# Altium schematic sheet PowerSupply.SchDoc
size A3; SheetNumber: 3; SheetTotal: 6
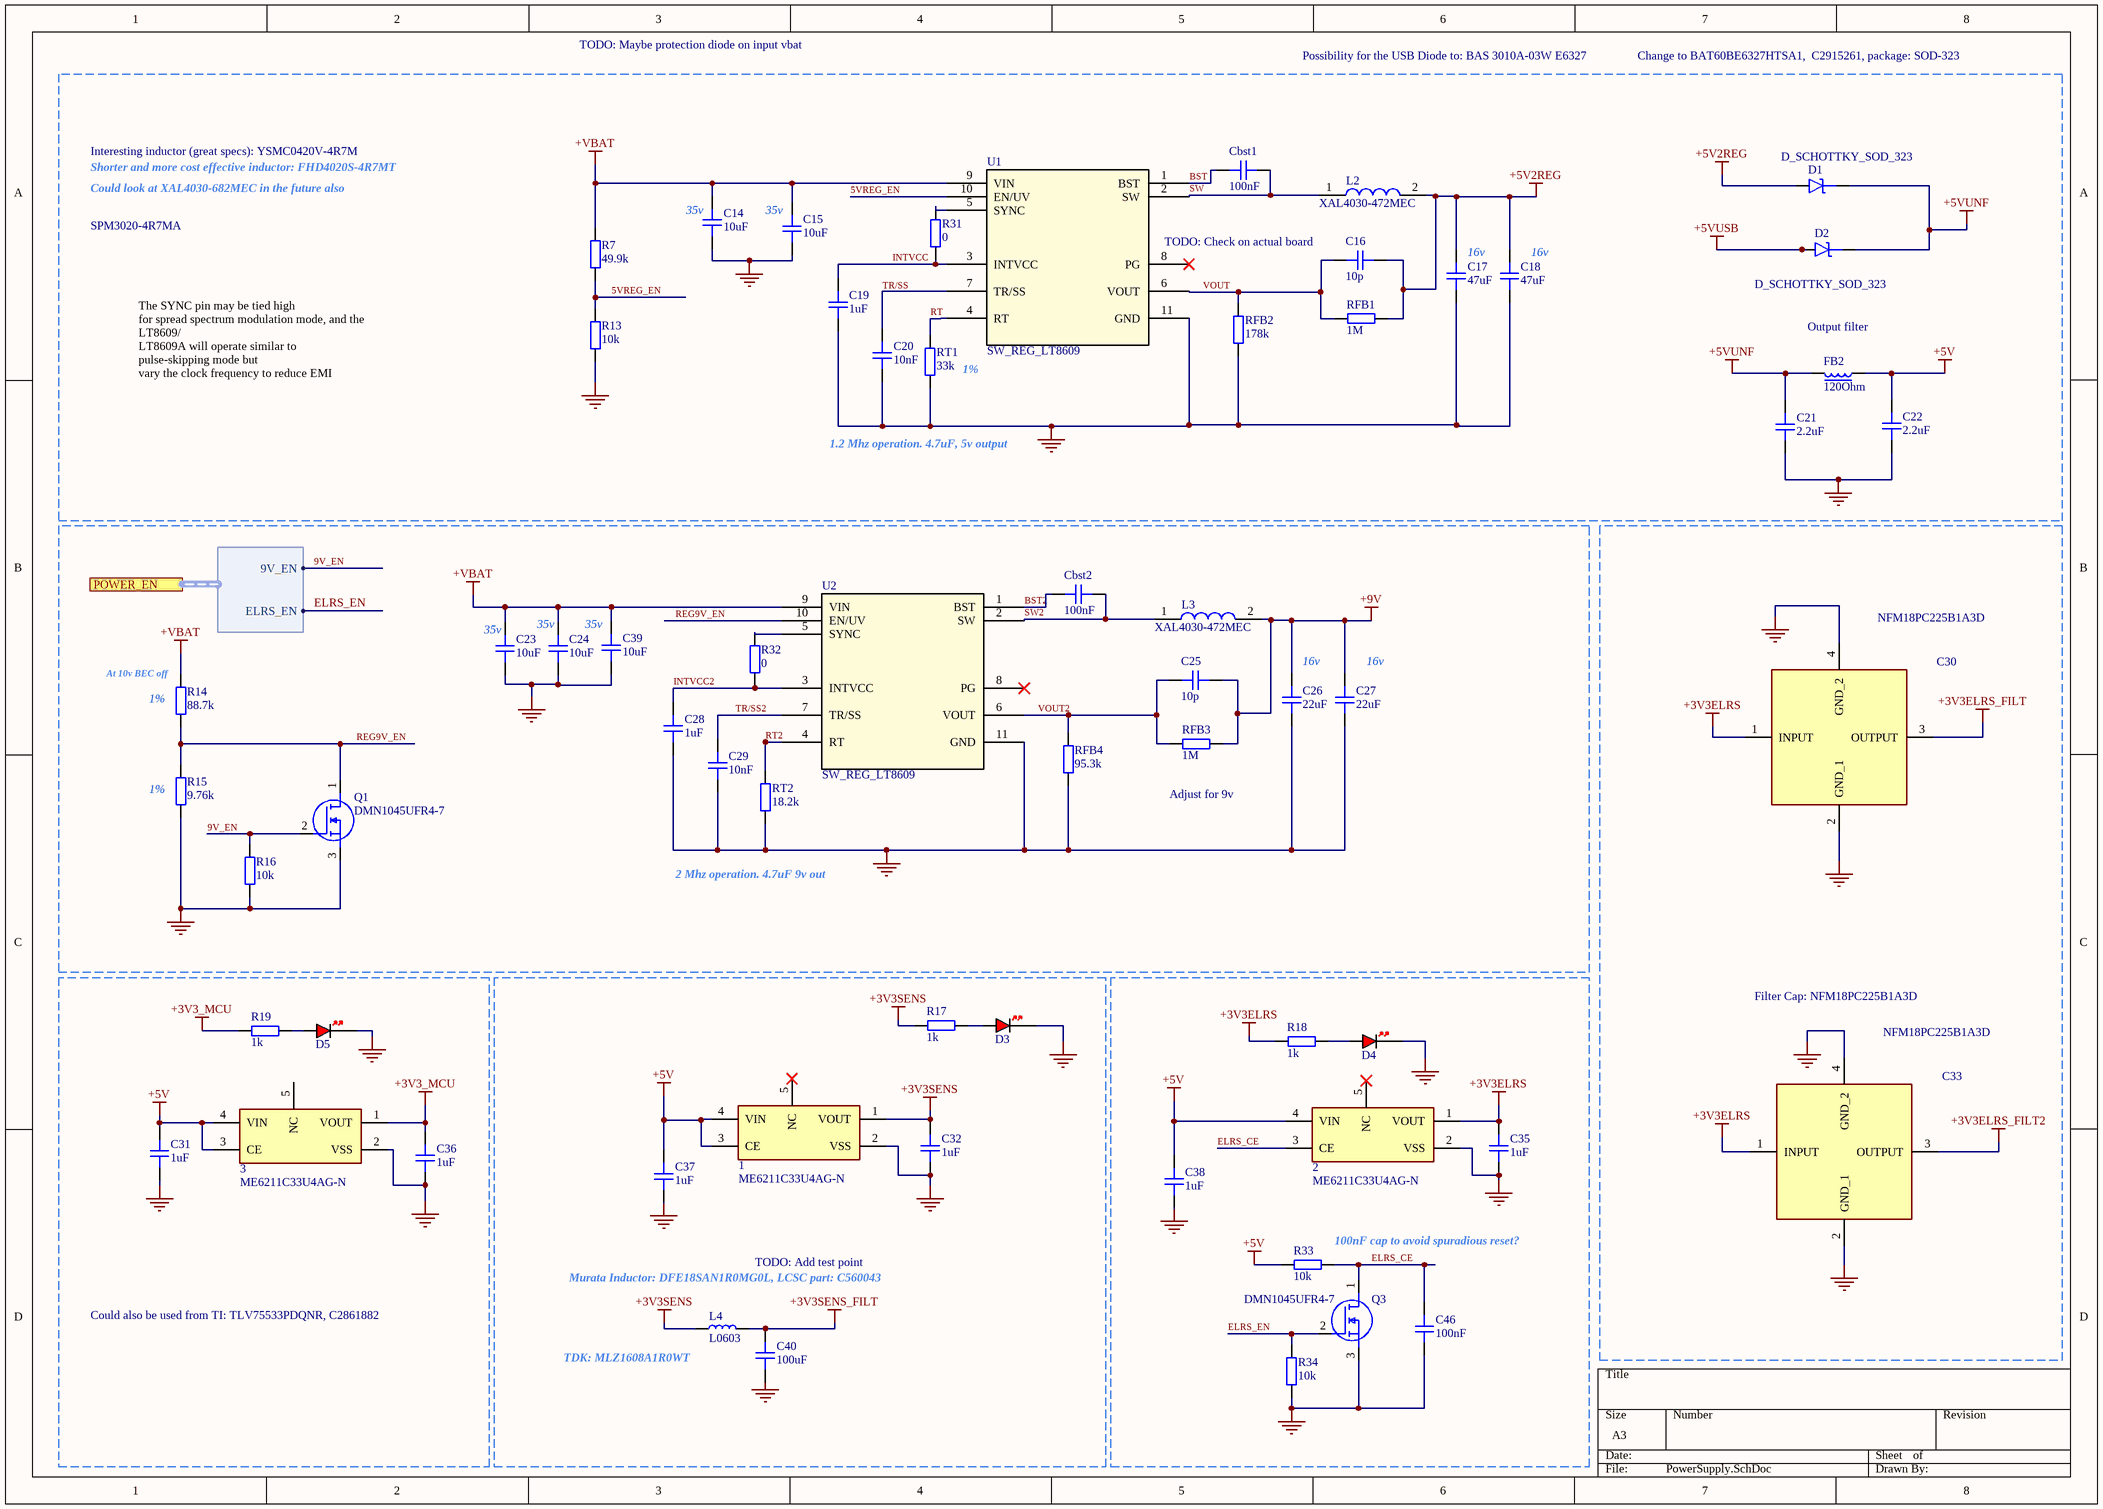
[diagram p0: PowerSupply.SchDoc]

## Parts
1  ME6211C33U4AG-N  [X2-SON-4-EP(1x1)]
2  ME6211C33U4AG-N  [X2-SON-4-EP(1x1)]
3  ME6211C33U4AG-N  [X2-SON-4-EP(1x1)]
C14  10uF  [CAP_0805]
C15  10uF  [CAP_0805]
C16  10p  [CAP_0201]
C17  47uF  [CAP_0603]
C18  47uF  [CAP_0603]
C19  1uF  [CAP_0402]
C20  10nF  [CAP_0201]
C21  2.2uF  [CAP_0402]
C22  2.2uF  [CAP_0402]
C23  10uF  [CAP_0805]
C24  10uF  [CAP_0805]
C25  10p  [CAP_0201]
C26  22uF  [CAP_0603]
C27  22uF  [CAP_0603]
C28  1uF  [CAP_0402]
C29  10nF  [CAP_0201]
C30  NFM18PC225B1A3D  [NFM18PC225B1A3D]
C31  1uF  [CAP_0402]
C32  1uF  [CAP_0402]
C33  NFM18PC225B1A3D  [NFM18PC225B1A3D]
C35  1uF  [CAP_0402]
C36  1uF  [CAP_0402]
C37  1uF  [CAP_0402]
C38  1uF  [CAP_0402]
C39  10uF  [CAP_0603]
C40  100uF  [CAP_0805]
C46  100nF  [CAP_0201]
Cbst1  100nF  [CAP_0201]
Cbst2  100nF  [CAP_0201]
D1  D_SCHOTTKY_SOD_323  [SOD-323]
D2  D_SCHOTTKY_SOD_323  [SOD-323]
D3  RED  [LED_0402_RED]  (value not drawn)
D4  RED  [LED_0402_RED]  (value not drawn)
D5  RED  [LED_0402_RED]  (value not drawn)
FB2  120Ohm  [FB_0603]
L2  XAL4030-472MEC  [IND-SMD_L4.0-W4.0]
L3  XAL4030-472MEC  [IND-SMD_L4.0-W4.0]
L4  L0603  [IND_0603]
Q1  DMN1045UFR4-7  [DMP1200UFR47]
Q3  DMN1045UFR4-7  [DMP1200UFR47]
R7  49.9k  [RES_0402]
R13  10k  [RES_0201]
R14  88.7k  [RES_0402]
R15  9.76k  [RES_0201]
R16  10k  [RES_0201]
R17  1k  [RES_0201]
R18  1k  [RES_0201]
R19  1k  [RES_0201]
R31  0  [RES_0201]
R32  0  [RES_0201]
R33  10k  [RES_0201]
R34  10k  [RES_0201]
RFB1  1M  [RES_0201]
RFB2  178k  [RES_0201]
RFB3  1M  [RES_0201]
RFB4  95.3k  [RES_0201]
RT1  33k  [RES_0201]
RT2  18.2k  [RES_0201]
U1  SW_REG_LT8609  [SW_REG_LT8609]
U2  SW_REG_LT8609  [SW_REG_LT8609]

## Blocks framed on the sheet
Filter Cap: NFM18PC225B1A3D: C30 C33
Could also be used from TI: TLV75533PDQNR, C2861882: 3 C31 C36 D5 R19
100nF cap to avoid spuradious reset?: 2 C35 C38 C46 D4 Q3 R18 R33 R34

## Ports
POWER_EN (harness VTX_EN, see Overview[1A], MCU[8C])

## Harnesses
VTX_EN: 9V_EN, ELRS_EN

## Nets
+3V3_MCU: 3.1(VOUT) C36.2 R19.1
+3V3ELRS: 2.1(VOUT) C30.1(INPUT) C33.1(INPUT) C35.2 R18.1
+3V3ELRS_FILT: C30.3(OUTPUT)
+3V3ELRS_FILT2: C33.3(OUTPUT)
+3V3SENS: 1.1(VOUT) C32.2 L4.1 R17.1
+3V3SENS_FILT: C40.2 L4.2
+5V: 1.3(CE) 1.4(VIN) 2.4(VIN) 3.3(CE) 3.4(VIN) C22.2 C31.2 C37.2 C38.2 FB2.1 R33.2
+5V2REG: C16.2 C17.1 C18.1 D1.A L2.2 RFB1.1
+5VUNF: C21.2 D1.K D2.K FB2.2
+5VUSB: D2.A
+9V: C25.2 C26.1 C27.1 L3.2 RFB3.1
+VBAT: C14.2 C15.2 C23.2 C24.2 C39.2 R7.2 R14.2 U1.9(VIN) U2.9(VIN)
GND: 1.2(VSS) 2.2(VSS) 3.2(VSS) C14.1 C15.1 C17.2 C18.2 C19.1 C20.1 C21.1 C22.1 C23.1 C24.1 C26.2 C27.2 C28.1 C29.1 C30.2(GND_1) C30.4(GND_2) C31.1 C32.1 C33.2(GND_1) C33.4(GND_2) C35.1 C36.1 C37.1 C38.1 C39.1 C40.1 C46.1 D3.K D4.K D5.K Q1.3(S) Q3.3(S) R13.1 R15.1 R16.1 R34.1 RFB2.1 RFB4.1 RT1.1 RT2.2 U1.11(GND) U2.11(GND)
5VREG_EN: R7.1 R13.2 U1.10(EN/UV)
9V_EN: Q1.2(G) R16.2 ; port POWER_EN.9V_EN
BST: Cbst1.1 U1.1(BST)
BST2: Cbst2.1 U2.1(BST)
ELRS_CE: 2.3(CE) C46.2 Q3.1(D) R33.1
ELRS_EN: Q3.2(G) R34.2 ; port POWER_EN.ELRS_EN
INTVCC: C19.2 R31.1 U1.3(INTVCC)
INTVCC2: C28.2 R32.1 U2.3(INTVCC)
REG9V_EN: Q1.1(D) R14.1 R15.2 U2.10(EN/UV)
RT: RT1.2 U1.4(RT)
RT2: RT2.1 U2.4(RT)
SW: Cbst1.2 L2.1 U1.2(SW)
SW2: Cbst2.2 L3.1 U2.2(SW)
TR/SS: C20.2 U1.7(TR/SS)
TR/SS2: C29.2 U2.7(TR/SS)
VOUT: C16.1 RFB1.2 RFB2.2 U1.6(VOUT)
VOUT2: C25.1 RFB3.2 RFB4.2 U2.6(VOUT)
NetD3_A: D3.A R17.2
NetD4_A: D4.A R18.2
NetD5_A: D5.A R19.2
NetR31_2: R31.2 U1.5(SYNC)
NetR32_2: R32.2 U2.5(SYNC)

Not connected (* = marked no-connect by the designer): 1 5(NC)*; 2 5(NC)*; 3 5(NC); U1 8(PG)*; U2 8(PG)*

## Notes on the sheet
- TODO: Maybe protection diode on input vbat
- Possibility for the USB Diode to: BAS 3010A-03W E6327
- Change to BAT60BE6327HTSA1,  C2915261, package: SOD-323
- Shorter and more cost effective inductor: FHD4020S-4R7MT
- Interesting inductor (great specs): YSMC0420V-4R7M
- Could look at XAL4030-682MEC in the future also
- SPM3020-4R7MA
- (near C14) 35v
- (near C15) 35v
- TODO: Check on actual board
- (near C17) 16v
- (near C18) 16v
- 1%
- (near FB2) Output filter
- The SYNC pin may be tied high
  for spread spectrum modulation mode, and the LT8609/
  LT8609A will operate similar to pulse-skipping mode but
  vary the clock frequency to reduce EMI
- 1.2 Mhz operation. 4.7uF, 5v output
- (near C23) 35v
- (near C24) 35v
- (near C39) 35v
- (near R14) At 10v BEC off
- (near R14) 1%
- 16v
- (near C27) 16v
- (near R15) 1%
- (near RFB3) Adjust for 9v
- 2 Mhz operation. 4.7uF 9v out
- Murata Inductor: DFE18SAN1R0MG0L, LCSC part: C560043
- TODO: Add test point
- (near L4) TDK: MLZ1608A1R0WT

## Library data of the parts
1-3 = ME6211C33U4AG-N: Integrated Circuit; Manufacturer_Name: Microne; Manufacturer_Part_Number: ME6211C33M5G-N; Datasheet Link: https://datasheet.lcsc.com/szlcsc/1811131510_MICRONE-Nanjing-Micro-One-Elec-ME6211C33M5G-N_C82942.pdf; Height: 1.45mm; LCSC Part #: C82942
C14 C15 C23 C24 C40 = CAP_0805: Capacitor SMD 0805; Manufacturer: *; Manufacturer Part Number: *; Distributor Link: *; LCSC: *; Rating: *; Dielectric: *
C16 C20 C25 C29 C46 Cbst1 Cbst2 = CAP_0201: Capacitor SMD 0201; Manufacturer: *; Manufacturer Part Number: *; Distributor Link: *; LCSC: *; Rating: *; Dielectric: *
C17 C18 C26 C27 C39 = CAP_0603: Capacitor SMD 0603; Manufacturer: *; Manufacturer Part Number: *; Distributor Link: *; LCSC: *; Rating: *; Dielectric: *
C19 C21 C22 C28 C31 C32 C35-C38 = CAP_0402: Capacitor SMD 0402; Manufacturer: *; Manufacturer Part Number: *; Distributor Link: *; LCSC: *; Rating: *; Dielectric: *
C30 C33 = NFM18PC225B1A3D: Capacitor; Manufacturer_Name: Murata Electronics; Datasheet Link: https://search.murata.co.jp/Ceramy/image/img/A01X/G101/ENG/NFM18PC225B1A3-01.pdf; Height: 0.9mm; Manufacturer_Part_Number: NFM18PC225B1A3D; Mouser Part Number: 81-NFM18PC225B1A3D; Mouser Price/Stock: https://www.mouser.co.uk/ProductDetail/Murata-Electronics/NFM18PC225B1A3D?qs=%2F%252BYoplLUB5j1f96c1CfWTw%3D%3D; Arrow Part Number: NFM18PC225B1A3D; Arrow Price/Stock: https://www.arrow.com/en/products/nfm18pc225b1a3d/murata-manufacturing?region=europe
D1 D2 = D_SCHOTTKY_SOD_323: Diode Schottky SMD SOD-323
D3-D5 = LED_0402_RED: LED 0402 RED SMD
FB2 = FB_0603: Ferrite Bead SMD 0603; Manufacturer: *; Manufacturer Part Number: *; Distributor Link: *; LCSC: *
L2 L3 = XAL4030-472MEC: Inductor; Manufacturer_Name: COILCRAFT; Datasheet Link: https://www.mouser.com/datasheet/2/597/xal4000-270751.pdf; Height: 3.1mm; Manufacturer_Part_Number: XAL4030-472MEC; Mouser Part Number: 994-XAL4030-472MEC; Mouser Price/Stock: https://www.mouser.co.uk/ProductDetail/Coilcraft/XAL4030-472MEC?qs=zCSbvcPd3pZOjkLG9RPHEg%3D%3D
L4 = IND_0603: Inductor SMD 0603
Q1 Q3 = DMN1045UFR4-7: MOSFET (N-Channel); Manufacturer_Name: Diodes Incorporated; Datasheet Link: https://www.diodes.com//assets/Datasheets/DMN1045UFR4.pdf; Manufacturer_Part_Number: DMN1045UFR4-7; Mouser Part Number: 621-DMN1045UFR4-7; Mouser Price/Stock: https://www.mouser.co.uk/ProductDetail/Diodes-Incorporated/DMN1045UFR4-7?qs=OVC8WVYZliTSRHekNl8zHg%3D%3D; Arrow Part Number: DMN1045UFR4-7; Arrow Price/Stock: https://www.arrow.com/en/products/dmn1045ufr4-7/diodes-incorporated
R7 R14 = RES_0402: Resistor SMD 0402; Manufacturer: *; Manufacturer Part Number: *; Distributor Link: *; LCSC: *
R13 R15-R19 R31-R34 RFB1-RFB4 RT1 RT2 = RES_0201: Resistor SMD 0201; Manufacturer: *; Manufacturer Part Number: *; Distributor Link: *; LCSC: *
U1 U2 = SW_REG_LT8609: Mfr.Part: LT8609AJDDM#WTRPBF; LCSC Part #: C5122347